# EAGLE design my board3 (EAGLE 6.2)
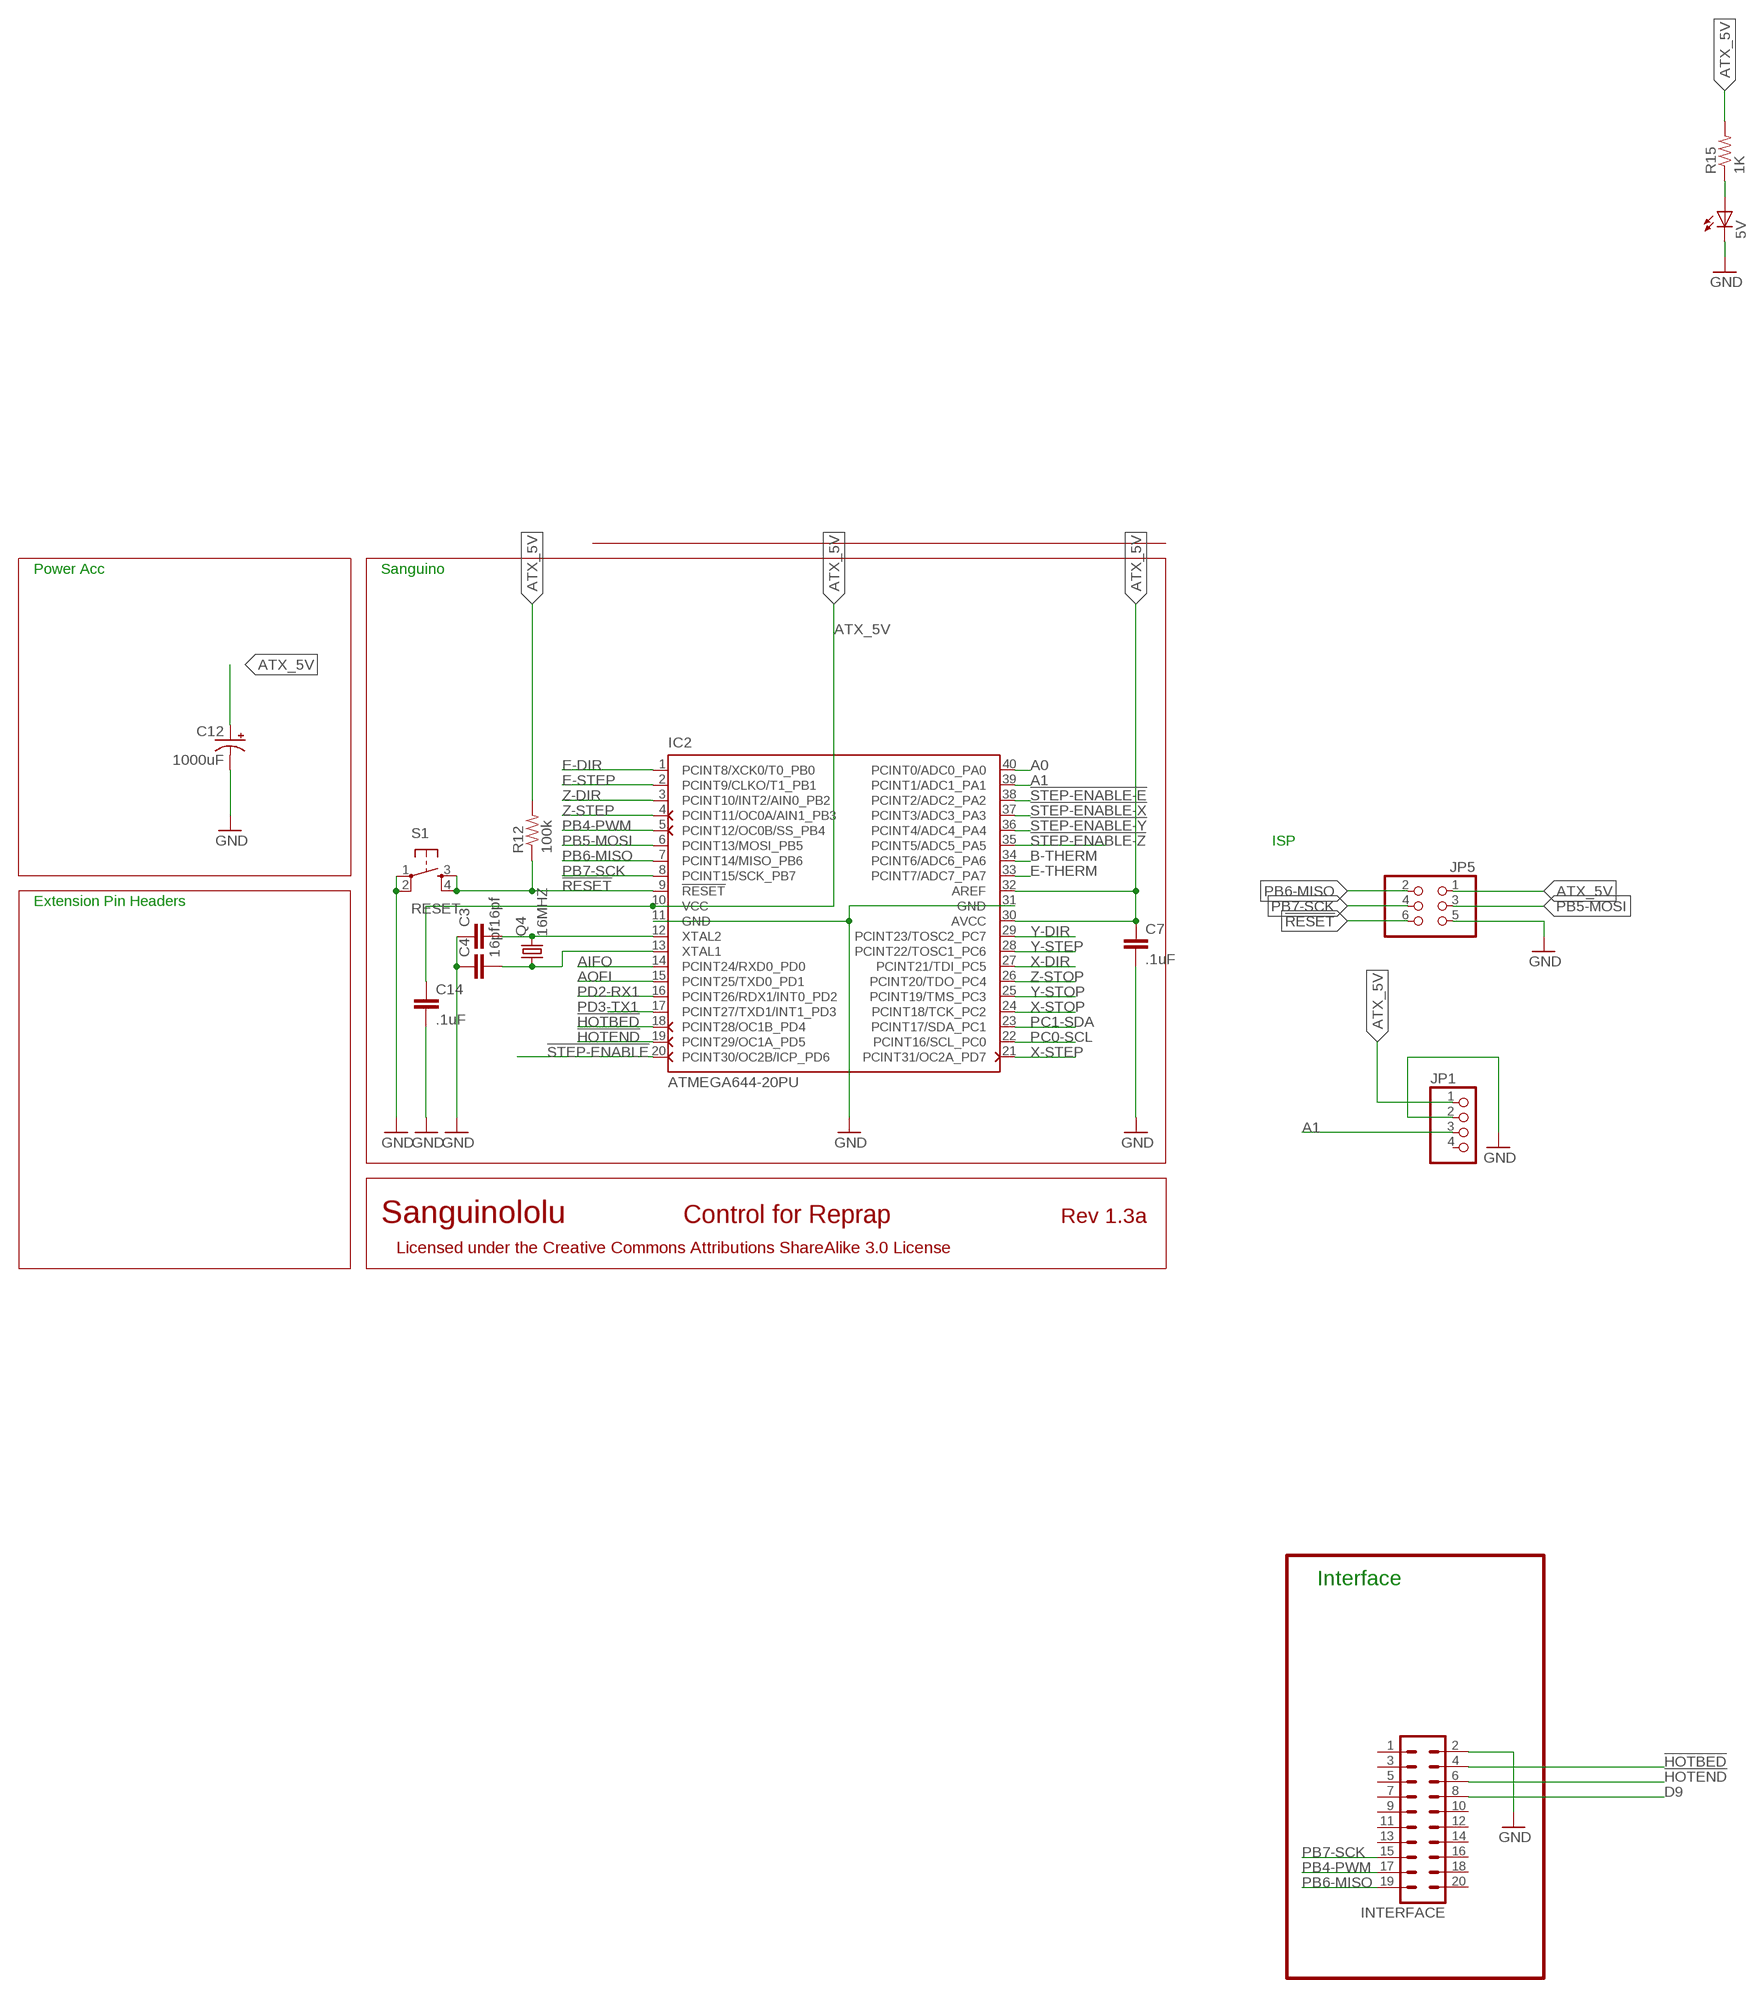
[diagram p0: schematic, sheet 1, part 1 of 2]
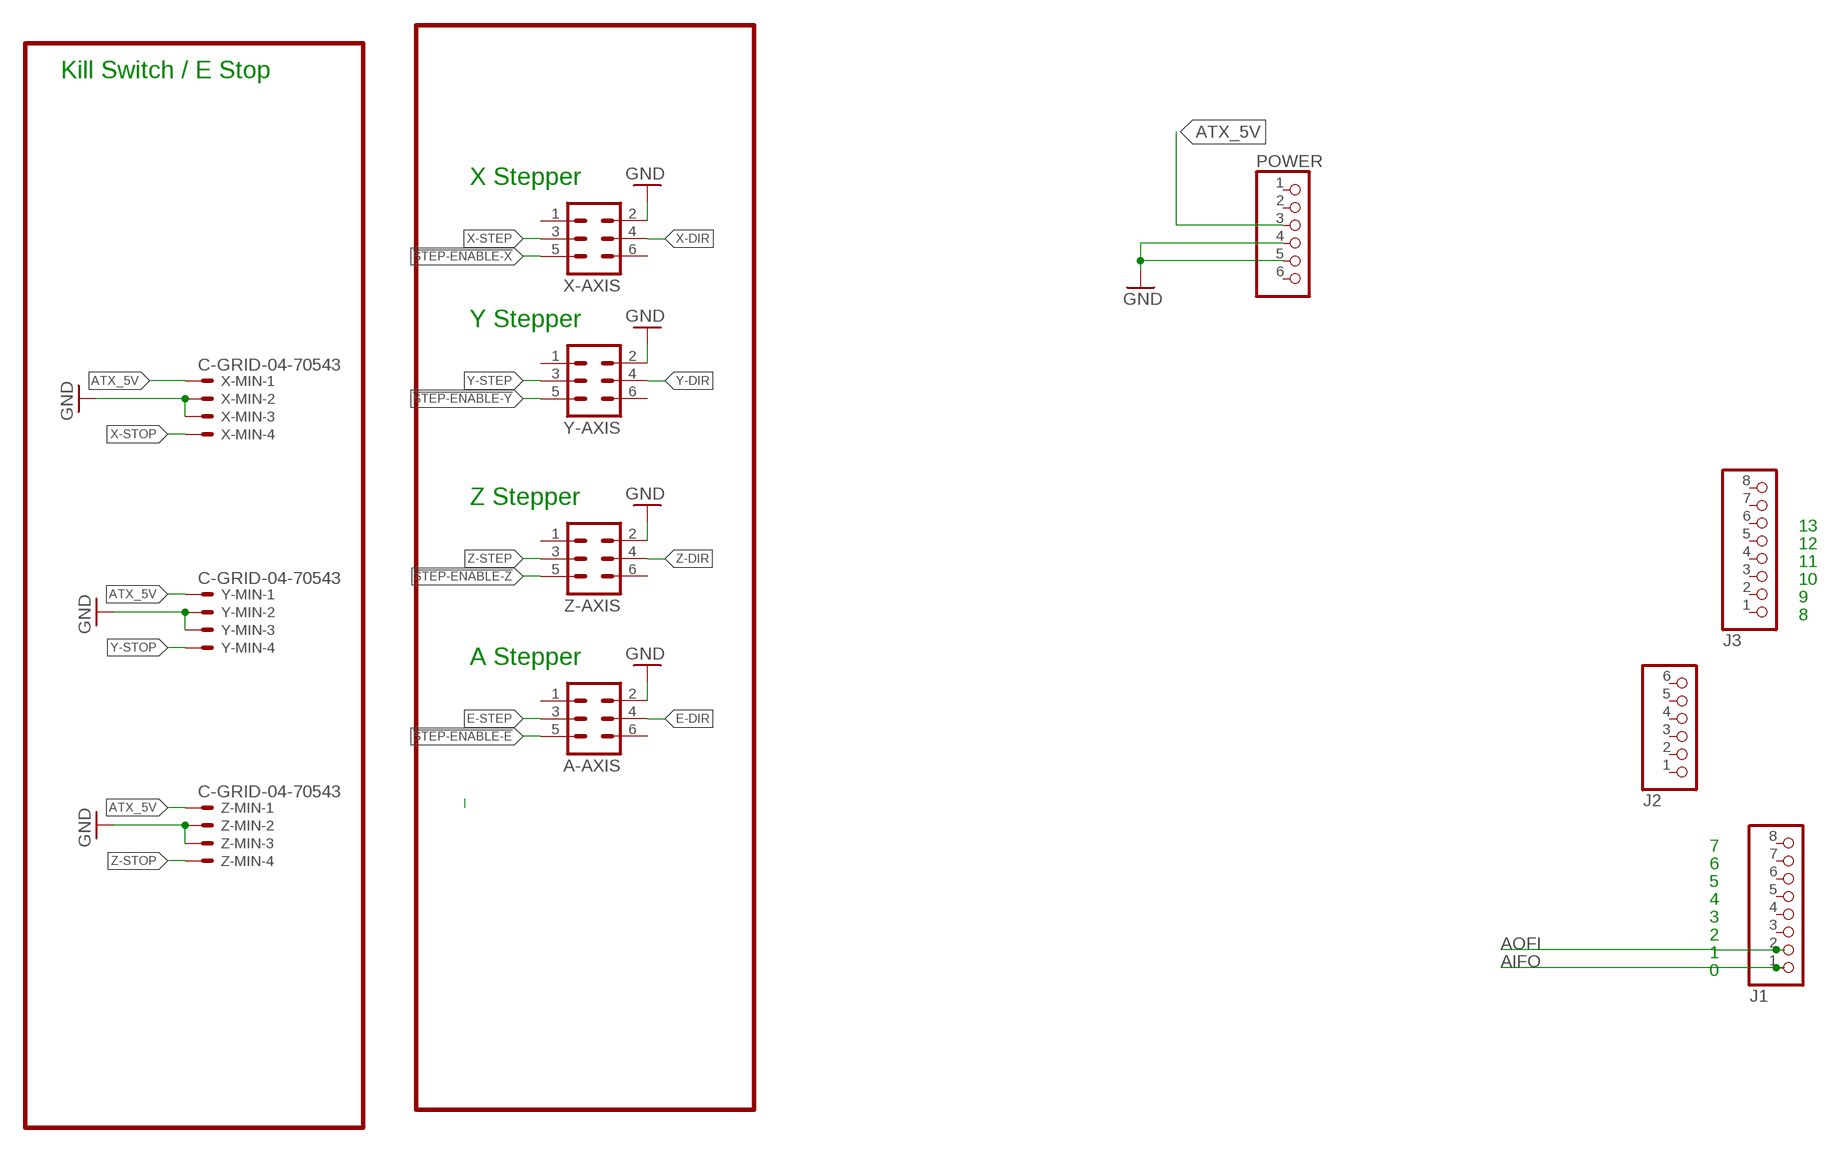
[diagram p1: schematic, sheet 1, part 2 of 2]

## Parts
5V  LED0805  [LED-0805]
A-AXIS  ML6  [ML6]
C3  16pf  CAP0805  [0805]
C4  16pf  CAP0805  [0805]
C7  .1uF  CAP0805  [0805]
C12  1000uF  CAP_POLPTH4  [CPOL-RADIAL-1000UF-25V]
C14  .1uF  CAP0805  [0805]
IC2  ATMEGA644-20PU  [DIL40]
INTERFACE  ML20  [ML20]
J1  PINHD-1X8  [1X08]
J2  PINHD-1X6  [1X06]
J3  PINHD-1X8  [1X08]
JP1  PINHD-1X4  [1X04]
JP5  PINHD-2X3  [2X03]
POWER  PINHD-1X6  [1X06]
Q4  16MHZ  CRYSTALHC49S  [HC49/S]
R12  100k  RESISTORPTH1  [AXIAL-0.3]
R15  1K  RESISTOR  [0805]
S1  RESET  TAC_SWITCHPTH  [TACTILE-PTH]
X-AXIS  ML6  [ML6]
X-MIN  C-GRID-04-70543  [70543-04]
Y-AXIS  ML6  [ML6]
Y-MIN  C-GRID-04-70543  [70543-04]
Z-AXIS  ML6  [ML6]
Z-MIN  C-GRID-04-70543  [70543-04]

## Nets
!HOTBED: IC2.18(PCINT28/OC1B_PD4) INTERFACE.4
!HOTEND: IC2.19(PCINT29/OC1A_PD5) INTERFACE.6
!RESET: IC2.9(!RESET) JP5.6 R12.P$1 S1.3 S1.4
!STEP-ENABLE: IC2.20(PCINT30/OC2B/ICP_PD6)
!STEP-ENABLE-E: A-AXIS.5 IC2.38(PCINT2/ADC2_PA2)
!STEP-ENABLE-X: IC2.37(PCINT3/ADC3_PA3) X-AXIS.5
!STEP-ENABLE-Y: IC2.36(PCINT4/ADC4_PA4) Y-AXIS.5
!STEP-ENABLE-Z: IC2.35(PCINT5/ADC5_PA5) Z-AXIS.5
A0: IC2.40(PCINT0/ADC0_PA0)
A1: IC2.39(PCINT1/ADC1_PA1) JP1.3
AIFO: IC2.14(PCINT24/RXD0_PD0) J1.1
AOFI: IC2.15(PCINT25/TXD0_PD1) J1.2
ATX_5V [usbvcc]: C7.1 C12.1(+) C14.1 IC2.10(VCC) IC2.30(AVCC) IC2.32(AREF) JP1.1 JP5.1 POWER.3 R12.P$2 R15.2 X-MIN.1 Y-MIN.1 Z-MIN.1
B-THERM: IC2.34(PCINT6/ADC6_PA6)
D9: INTERFACE.8
E-DIR: A-AXIS.4 IC2.1(PCINT8/XCK0/T0_PB0)
E-STEP: A-AXIS.3 IC2.2(PCINT9/CLKO/T1_PB1)
E-THERM: IC2.33(PCINT7/ADC7_PA7)
GND [gnd]: 5V.C A-AXIS.2 C3.1 C4.1 C7.2 C12.2(-) C14.2 IC2.11(GND) IC2.31(GND) INTERFACE.2 JP1.2 JP5.5 POWER.4 POWER.5 S1.1 S1.2 X-AXIS.2 X-MIN.2 X-MIN.3 Y-AXIS.2 Y-MIN.2 Y-MIN.3 Z-AXIS.2 Z-MIN.2 Z-MIN.3
N$25: 5V.A R15.1
N$31: C3.2 IC2.12(XTAL2) Q4.2
N$32: C4.2 IC2.13(XTAL1) Q4.1
PB4-PWM: IC2.5(PCINT12/OC0B/SS_PB4) INTERFACE.17
PB5-MOSI: IC2.6(PCINT13/MOSI_PB5) JP5.3
PB6-MISO: IC2.7(PCINT14/MISO_PB6) INTERFACE.19 JP5.2
PB7-SCK: IC2.8(PCINT15/SCK_PB7) INTERFACE.15 JP5.4
PC0-SCL: IC2.22(PCINT16/SCL_PC0)
PC1-SDA: IC2.23(PCINT17/SDA_PC1)
PD2-RX1: IC2.16(PCINT26/RDX1/INT0_PD2)
PD3-TX1: IC2.17(PCINT27/TXD1/INT1_PD3)
X-DIR: IC2.27(PCINT21/TDI_PC5) X-AXIS.4
X-STEP: IC2.21(PCINT31/OC2A_PD7) X-AXIS.3
X-STOP: IC2.24(PCINT18/TCK_PC2) X-MIN.4
Y-DIR: IC2.29(PCINT23/TOSC2_PC7) Y-AXIS.4
Y-STEP: IC2.28(PCINT22/TOSC1_PC6) Y-AXIS.3
Y-STOP: IC2.25(PCINT19/TMS_PC3) Y-MIN.4
Z-DIR: IC2.3(PCINT10/INT2/AIN0_PB2) Z-AXIS.4
Z-STEP: IC2.4(PCINT11/OC0A/AIN1_PB3) Z-AXIS.3
Z-STOP: IC2.26(PCINT20/TDO_PC4) Z-MIN.4
Unconnected: A-AXIS.1 A-AXIS.6 INTERFACE.1 INTERFACE.3 INTERFACE.5 INTERFACE.7 INTERFACE.9 INTERFACE.10 INTERFACE.11 INTERFACE.12 INTERFACE.13 INTERFACE.14 INTERFACE.16 INTERFACE.18 INTERFACE.20 J1.3 J1.4 J1.5 J1.6 J1.7 J1.8 J2.1 J2.2 J2.3 J2.4 J2.5 J2.6 J3.1 J3.2 J3.3 J3.4 J3.5 J3.6 J3.7 J3.8 JP1.4 POWER.1 POWER.2 POWER.6 X-AXIS.1 X-AXIS.6 Y-AXIS.1 Y-AXIS.6 Z-AXIS.1 Z-AXIS.6

## Notes on the sheet
- Power Acc | Sanguino
- Kill Switch / E Stop
- X Stepper
- ISP
- Extension Pin Headers
- Y Stepper
- Z Stepper
- 13
- 12
- 11
- 10
- 9
- 8
- Sanguinololu | Control for Reprap | Rev 1.3a
- A Stepper
- Licensed under the Creative Commons Attributions ShareAlike 3.0 License
- 7
- 6
- 5
- 4
- 3
- 2
- 1
- 0
- Interface

## Library data of the parts
5V = SparkFun:LED: LEDs Standard schematic elements and footprints for 5mm, 3mm, 1206, and 0603 sized LEDs. 5mm - Spark Fun Electronics SKU : COM-00529 (and others)
A-AXIS X-AXIS Y-AXIS Z-AXIS = con-ml:ML6: HARTING
C3 C4 C7 C14 = SparkFun:CAP: Capacitor Standard 0603 ceramic capacitor, and 0.1" leaded capacitor.
C12 = SparkFun:CAP_POL: Capacitor Polarized These are standard SMD and PTH capacitors. Normally 10uF, 47uF, and 100uF in electrolytic and tantalum varieties. Always verify the external diameter of the through hole cap, it varies with capacity, voltage, and manufacturer. The EIA devices should be standard.
IC2 = atmel:ATMEGA644-*PU: 8-bit Microcontroller with 64K Bytes In-System Programmable Flash Auto generated by make-symbol-device-package-bsdl.ulp Rev. 34 Source: http://www.atmel.com/dyn/resources/prod_documents/doc2593.pdf; MPN: ATMEGA644-20PU; OC_FARNELL: 1288340; OC_NEWARK: 23M5060
INTERFACE = con-harting-ml:ML20: HARTING
J1 J3 = pinhead:PINHD-1X8: PIN HEADER
J2 POWER = pinhead:PINHD-1X6: PIN HEADER
JP1 = pinhead:PINHD-1X4: PIN HEADER
JP5 = pinhead:PINHD-2X3: PIN HEADER
Q4 = crystal:CRYSTAL: CRYSTAL
R12 R15 = SparkFun:RESISTOR: Resistor Basic schematic elements and footprints for 0603, 1206, and PTH 1/10th watt (small) resistors.
S1 = SparkFun:TAC_SWITCH: Momentary Switch Button commonly used for reset or general input. Spark Fun Electronics SKU : COM-00097
X-MIN Y-MIN Z-MIN = con-molex:C-GRID-04: CONNECTOR wire to board 2.54 mm (0.100") pitch header

## Net classes
0 default: width 0.203 mm
1 power: width 0.254 mm
2 gnd: width 0.305 mm, drill 0.711 mm, clearance 0.203 mm
3 usbvcc: width 0.508 mm, drill 0.711 mm, clearance 0.203 mm
4 aref: width 0.406 mm

## Board
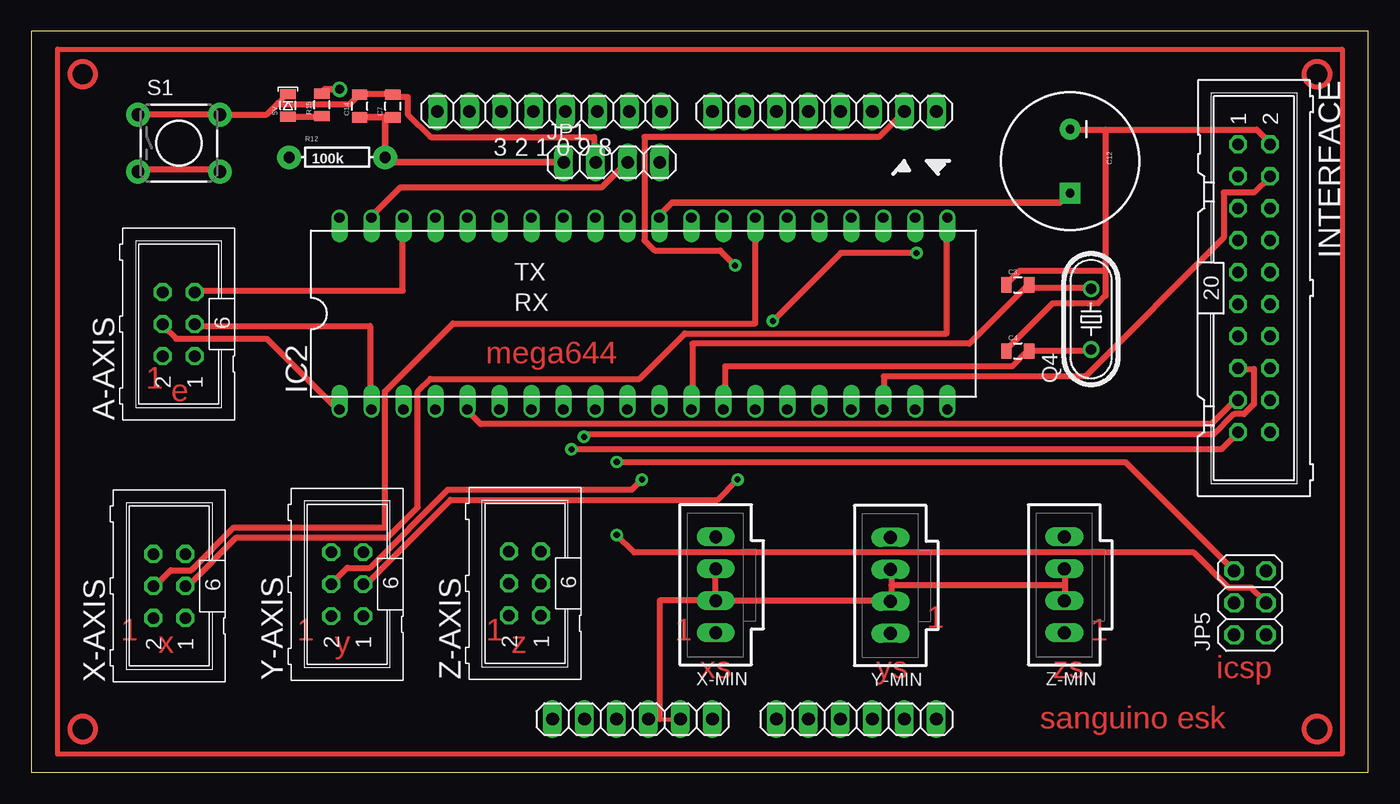
[diagram p2: board, top side]
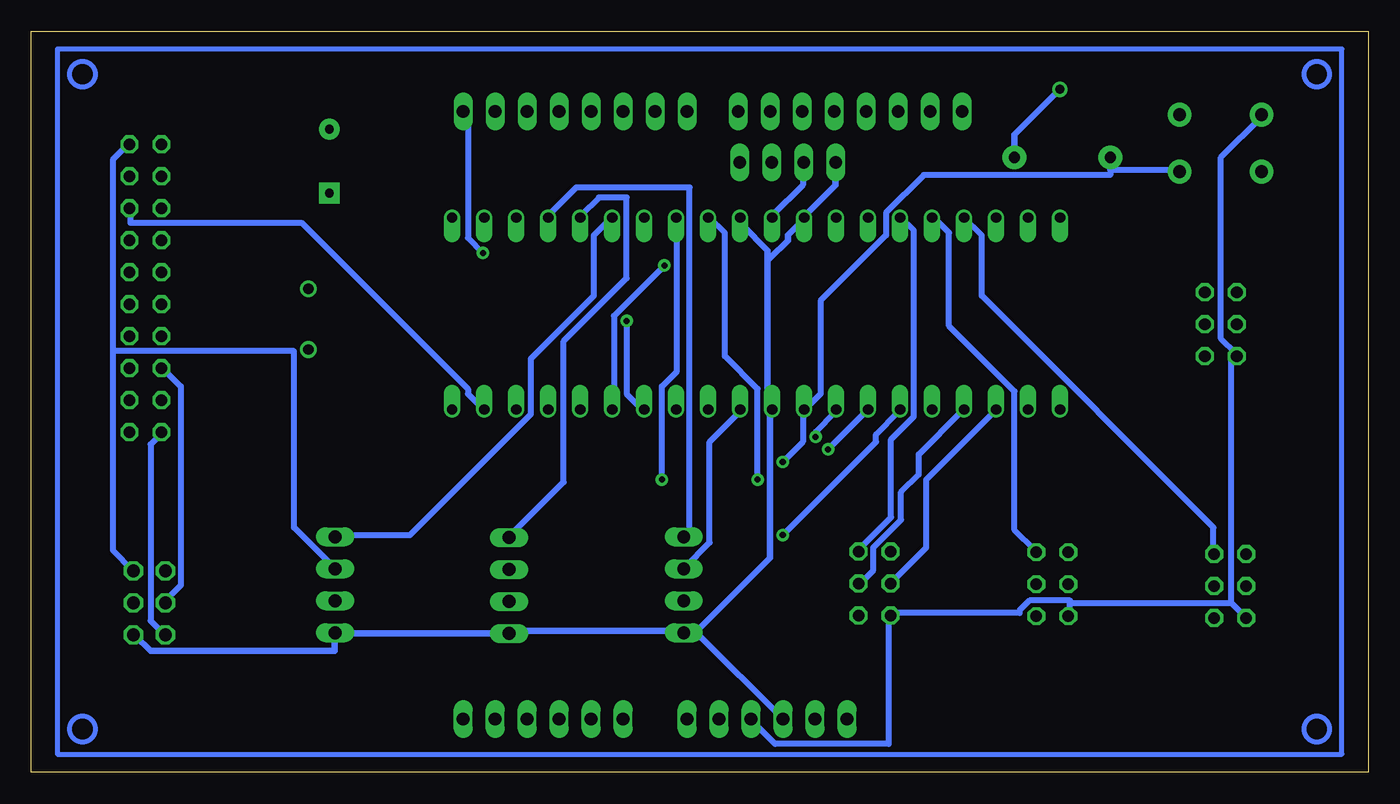
[diagram p3: board, bottom side, seen from below]

Size 106.12 x 58.84 mm. Coordinates in mm from the lower left corner, seen from the top.
Outline: 0,0 106.12,0 106.12,58.84 0,58.84 0,0
Copper layers (1*16): Top 0.035mm / dielectric 1.5mm / Bottom 0.035mm
Design rules: minimum track width 19mil, minimum drill 19mil, track to track 6mil, track to pad 6mil, pad to pad 6mil, via to via 6mil, smd to smd 6mil, copper to edge 30mil, drill to drill 6mil, minimum pad ring 10mil, minimum via ring 10mil, stop-mask expansion 4mil, vias tented up to drill 0mil, thermal gap 10mil

### Footprints (pad centres in the part's own frame; a part is rotated, then mirrored left to right if it is on the bottom)
LED-0805 = smd 1.2 x 0.8: A 0,-0.9; C 0,0.9
ML6 = drill 0.914 octagon: 1 -2.54,-1.27; 2 -2.54,1.27; 3 0,-1.27; 4 0,1.27; 5 2.54,-1.27; 6 2.54,1.27
0805 = smd 0.8 x 1.2: 1 -0.9,0; 2 0.9,0
CPOL-RADIAL-1000UF-25V = drill 0.7 pad 1.651 square: 1 2.54,0 | drill 0.7 pad 1.651: 2 -2.54,0
DIL40 = drill 0.813 offset: 1 -24.13,-7.62; 2 -21.59,-7.62; 3 -19.05,-7.62; 4 -16.51,-7.62; 5 -13.97,-7.62; 6 -11.43,-7.62; 7 -8.89,-7.62; 8 -6.35,-7.62; 9 -3.81,-7.62; 10 -1.27,-7.62; 11 1.27,-7.62; 12 3.81,-7.62; 13 6.35,-7.62; 14 8.89,-7.62; 15 11.43,-7.62; 16 13.97,-7.62; 17 16.51,-7.62; 18 19.05,-7.62; 19 21.59,-7.62; 20 24.13,-7.62; 21 24.13,7.62; 22 21.59,7.62; 23 19.05,7.62; 24 16.51,7.62; 25 13.97,7.62; 26 11.43,7.62; 27 8.89,7.62; 28 6.35,7.62; 29 3.81,7.62; 30 1.27,7.62; 31 -1.27,7.62; 32 -3.81,7.62; 33 -6.35,7.62; 34 -8.89,7.62; 35 -11.43,7.62; 36 -13.97,7.62; 37 -16.51,7.62; 38 -19.05,7.62; 39 -21.59,7.62; 40 -24.13,7.62
ML20 = drill 0.914 octagon: 1 -11.43,-1.27; 2 -11.43,1.27; 3 -8.89,-1.27; 4 -8.89,1.27; 5 -6.35,-1.27; 6 -6.35,1.27; 7 -3.81,-1.27; 8 -3.81,1.27; 9 -1.27,-1.27; 10 -1.27,1.27; 11 1.27,-1.27; 12 1.27,1.27; 13 3.81,-1.27; 14 3.81,1.27; 15 6.35,-1.27; 16 6.35,1.27; 17 8.89,-1.27; 18 8.89,1.27; 19 11.43,-1.27; 20 11.43,1.27
1X08 = drill 1.016 long: 1 -8.89,0; 2 -6.35,0; 3 -3.81,0; 4 -1.27,0; 5 1.27,0; 6 3.81,0; 7 6.35,0; 8 8.89,0
1X06 = drill 1.016 long: 1 -6.35,0; 2 -3.81,0; 3 -1.27,0; 4 1.27,0; 5 3.81,0; 6 6.35,0
1X04 = drill 1.016 long: 1 -3.81,0; 2 -1.27,0; 3 1.27,0; 4 3.81,0
2X03 = drill 1.016 octagon: 1 -2.54,-1.27; 2 -2.54,1.27; 3 0,-1.27; 4 0,1.27; 5 2.54,-1.27; 6 2.54,1.27
HC49/S = drill 0.813: 1 -2.413,0; 2 2.413,0
AXIAL-0.3 = drill 0.9 pad 1.88: P$1 -3.81,0; P$2 3.81,0
TACTILE-PTH = drill 1.016 pad 1.88: 1 -3.251,2.261; 2 3.251,2.261; 3 -3.251,-2.261; 4 3.251,-2.261
70543-04 = drill 1.016 long: 1 -3.81,0; 2 -1.27,0; 3 1.27,0; 4 3.81,0

### Placement (x,y rotation side)
5V  20.36,52.96 0 top
A-AXIS  11.69,35.59 90 top
C3  78.32,38.72 0 top
C4  78.32,33.48 0 top
C7  28.69,52.91 90 top
C12  82.47,48.54 270 top
C14  26.05,52.91 90 top
IC2  48.58,36.44 0 top
INTERFACE  97.07,38.45 270 top
J1  62.96,52.49 180 top
J2  65.5,4.23 0 top
J3  41.12,52.49 180 top
JP1  46.07,48.45 0 top
JP5  96.76,13.46 90 top
POWER  47.72,4.23 0 top
Q4  84.13,35.99 90 top
R12  24.27,48.85 0 top
R15  23.05,53.01 90 top
S1  11.71,49.97 0 top
X-AXIS  10.94,14.79 90 top
X-MIN  54.32,14.9 90 top
Y-AXIS  25.06,14.95 90 top
Y-MIN  68.19,14.85 90 top
Z-AXIS  39.19,15 90 top
Z-MIN  82.01,14.9 90 top

### Tracks (layer width: path | path; a pad name or v marks a point on that pad's centre or on a via)
!HOTBED
  Top 0.483: IC2.18 67.67,28.85 67.67,31.45 83.67,31.45 94.67,42.45 94.67,46.05 97.07,46.05 98.27,47.25 INTERFACE.4
!HOTEND
  Bottom 0.483: IC2.19 70.27,28.85 71.47,30.05 71.47,30.45 84.67,43.65 98.27,43.65 98.27,44.65 INTERFACE.6
!RESET  (via drill 0.48)
  Top 0.483: 8.47,47.85 S1.3 8.67,47.85 14.67,47.85 S1.4 14.87,47.85 | v46.47,24.65 86.87,24.65 95.47,16.05 JP5.6
  Bottom 0.483: 20.47,47.85 20.47,48.65 R12.P$1 | 20.47,47.85 20.47,47.45 35.27,47.45 38.27,44.45 38.27,42.65 43.47,37.45 43.47,30.05 44.67,28.85 IC2.9 44.87,28.65 44.87,26.25 v46.47,24.65 | 20.47,47.85 15.07,47.85 S1.4
!STEP-ENABLE-E
  Top 0.483: IC2.38 29.47,44.05 29.47,38.25 13.07,38.25 A-AXIS.5
!STEP-ENABLE-X
  Bottom 0.483: IC2.37 30.67,42.65 30.67,37.85 12.27,19.45 12.27,17.45 X-AXIS.5
!STEP-ENABLE-Y
  Bottom 0.483: IC2.36 34.47,44.05 33.27,42.85 33.27,35.45 28.07,30.25 28.07,19.25 26.47,17.65 Y-AXIS.5
!STEP-ENABLE-Z
  Bottom 0.483: IC2.35 37.07,44.05 36.07,43.05 36.07,28.25 37.87,26.45 37.87,20.25 40.27,17.85 40.27,17.65 Z-AXIS.5
A1
  Top 0.483: IC2.39 27.07,44.25 29.27,46.45 45.27,46.45 47.27,48.45 JP1.3
AIFO  (via drill 0.48)
  Top 0.483: v58.87,35.85 64.27,41.25 v70.27,41.25
  Bottom 0.483: v58.87,35.85 58.87,30.05 57.67,28.85 IC2.14 | v70.27,41.25 71.47,42.45 71.47,52.25 71.67,52.45 J1.1
AOFI  (via drill 0.48)
  Top 0.483: v55.87,40.25 54.67,41.45 49.47,41.45 48.67,42.25 48.67,50.45 67.27,50.45 69.27,52.45 J1.2
  Bottom 0.483: v55.87,40.25 59.87,36.25 59.87,28.85 IC2.15
ATX_5V  (via drill 0.71)
  Top 0.508: 28.07,52.05 28.67,52.05 C7.1 | 28.07,52.05 26.07,52.05 C14.1 | v24.47,54.25 23.27,54.25 23.07,54.05 R15.2 | 28.07,52.05 R12.P$2 28.27,48.65 28.47,48.45 JP1.1 | C12.1 82.27,45.85 81.67,45.25 50.87,45.25 49.87,44.25 IC2.30
  Bottom 0.508: POWER.3 46.47,4.25 53.27,11.05 54.27,11.05 X-MIN.1 | JP5.1 97.87,10.85 96.67,9.65 82.07,9.65 82.07,10.85 Z-MIN.1 81.87,11.05 68.27,11.05 Y-MIN.1 68.07,11.25 54.47,11.25 X-MIN.1 | v24.47,54.25 28.07,50.65 R12.P$2 | JP1.1 42.27,46.65 44.67,44.25 IC2.32 44.87,43.85 46.07,42.65 46.07,42.25 47.47,40.85 47.67,40.85 | 47.67,40.85 47.67,41.45 49.67,43.45 49.67,44.05 IC2.30 | 47.67,40.85 47.67,29.05 47.47,28.85 IC2.10 47.47,28.65 47.47,17.05 53.27,11.25 X-MIN.1
E-DIR
  Top 0.483: IC2.1 24.27,28.85 18.67,34.45 11.47,34.45 10.47,35.45 A-AXIS.4
E-STEP
  Top 0.483: IC2.2 26.87,28.85 26.87,35.45 13.07,35.45 A-AXIS.3
GND
  Top 0.305: POWER.4 49.87,4.23 POWER.5
  Top 0.483: 47.27,44.05 IC2.31 | 49.87,28.85 IC2.11 | X-MIN.2 54.27,13.65 54.27,16.05 X-MIN.3 | 85.27,39.85 85.27,37.85 84.67,37.25 81.07,37.25 77.47,33.65 C4.1 | 85.27,39.85 78.47,39.85 77.47,38.85 C3.1 | 85.27,51.05 82.47,51.05 C12.2 | 85.27,51.05 97.27,51.05 98.27,50.05 INTERFACE.2 | 85.27,51.05 85.27,39.85 | 68.27,14.85 68.27,16.05 Y-MIN.3 | 68.27,14.85 68.27,13.65 Y-MIN.2 68.07,13.65 54.47,13.65 X-MIN.2 | 82.07,14.85 82.07,16.05 Z-MIN.3 | 82.07,14.85 82.07,13.65 Z-MIN.2 | 82.07,14.85 68.27,14.85 | 49.87,4.23 49.87,13.65 54.07,13.65 X-MIN.2 | 19.57,53.15 18.67,52.25 15.07,52.25 S1.2 14.87,52.25 8.47,52.25 S1.1 | 19.57,53.15 20.27,53.85 5V.C | 19.57,53.15 19.67,53.05 25.27,53.05 25.87,53.65 C14.2 26.07,53.85 28.67,53.85 C7.2 28.87,53.65 29.87,53.65 29.87,52.25 31.67,50.45 44.67,50.45 44.67,48.45 JP1.2
  Bottom 0.483: 99.67,33.45 99.67,48.65 98.47,49.85 INTERFACE.2 | 99.67,33.45 99.67,17.65 98.07,16.05 JP5.5 | IC2.11 49.87,28.65 52.27,26.25 52.27,18.25 54.27,16.25 X-MIN.3 | IC2.31 47.27,44.25 44.87,46.65 44.87,48.45 JP1.2 | 10.87,13.45 9.87,12.45 X-AXIS.2 | 23.67,13.45 10.87,13.45 | 23.67,13.45 23.67,12.45 Y-AXIS.2 | 23.67,13.45 23.67,13.65 26.87,13.65 27.67,12.85 27.67,12.65 37.87,12.65 Z-AXIS.2 38.07,12.25 38.07,2.25 47.07,2.25 48.87,4.05 POWER.4 | 10.87,13.45 10.87,32.65 10.47,33.05 A-AXIS.2 10.47,33.25 11.67,34.45 11.67,48.85 8.47,52.05 S1.1 | 99.67,33.45 85.27,33.45 85.27,19.45 82.07,16.25 Z-MIN.3
N$1
  Top 0.406: 2.07,57.45 104.07,57.45 104.07,1.45 2.07,1.45 2.07,57.45
N$2
  Bottom 0.406: 2.07,57.45 104.07,57.45 104.07,1.45 2.07,1.45 2.07,57.45
N$25
  Top 0.483: 5V.A 20.47,52.05 22.87,52.05 R15.1
N$31
  Top 0.483: Q4.2 84.07,38.45 79.47,38.45 79.27,38.65 C3.2 79.07,38.65 74.47,34.05 52.47,34.05 52.47,28.85 IC2.12
N$32
  Top 0.483: Q4.1 84.07,33.45 79.27,33.45 C4.2 79.07,33.45 77.87,32.25 55.07,32.25 55.07,28.85 IC2.13
PB4-PWM
  Top 0.483: IC2.5 34.67,28.65 35.67,27.65 93.67,27.65 95.47,29.45 95.67,29.45 INTERFACE.17
PB5-MOSI  (via drill 0.48)
  Top 0.483: v46.47,18.85 47.87,17.45 92.27,17.45 95.07,14.65 96.87,14.65 97.87,13.65 JP5.3
  Bottom 0.483: v46.47,18.85 39.07,26.25 39.07,26.85 37.27,28.65 IC2.6
PB6-MISO  (via drill 0.48)
  Top 0.483: v42.87,25.65 94.47,25.65 95.67,26.85 INTERFACE.19
  Bottom 0.483: v42.87,25.65 39.87,28.65 IC2.7 | JP5.2 95.67,11.05 96.67,12.05 96.67,26.05 95.87,26.85 INTERFACE.19
PB7-SCK  (via drill 0.48)
  Top 0.483: v43.87,26.65 44.07,26.85 93.87,26.85 95.47,28.45 96.27,28.45 97.07,29.25 97.07,32.05 95.87,32.05 INTERFACE.15
  Bottom 0.483: v43.87,26.65 43.87,27.05 42.27,28.65 IC2.8 | JP5.4 95.47,13.65 94.27,14.85 94.27,30.65 95.67,32.05 INTERFACE.15
X-DIR
  Top 0.483: IC2.27 57.47,35.65 33.47,35.65 28.07,30.25 28.07,19.45 16.07,19.45 12.67,16.05 11.07,16.05 9.87,14.85 X-AXIS.4
X-STEP
  Top 0.483: IC2.21 72.67,44.05 72.67,34.85 51.87,34.85 48.27,31.25 31.67,31.25 30.67,30.25 30.67,21.05 28.27,18.65 16.27,18.65 12.47,14.85 12.27,14.85 X-AXIS.3
X-STOP
  Bottom 0.483: IC2.24 65.07,44.25 62.87,46.45 53.87,46.45 53.87,19.25 54.27,18.85 X-MIN.4
Y-DIR  (via drill 0.48)
  Top 0.483: v48.47,23.25 47.67,22.45 33.07,22.45 26.87,16.25 25.07,16.25 23.87,15.05 Y-AXIS.4
  Bottom 0.483: v48.47,23.25 48.47,30.45 51.07,33.05 51.07,42.85 52.27,44.05 IC2.29
Y-STEP  (via drill 0.48)
  Top 0.483: v56.07,23.25 54.47,21.65 33.27,21.65 26.67,15.05 26.47,15.05 Y-AXIS.3
  Bottom 0.483: v56.07,23.25 56.07,30.65 54.87,31.85 54.87,44.05 IC2.28
Y-STOP
  Bottom 0.483: IC2.25 62.47,44.25 61.07,45.65 58.87,45.65 58.87,39.25 63.87,34.25 63.87,23.05 68.07,18.85 Y-MIN.4
Z-DIR
  Bottom 0.483: IC2.3 29.67,28.65 35.07,23.25 35.07,17.85 37.87,15.05 Z-AXIS.4
Z-STEP
  Bottom 0.483: IC2.4 32.27,28.65 35.67,25.25 35.67,23.65 37.07,22.25 37.07,20.05 39.27,17.85 39.27,16.05 40.27,15.05 Z-AXIS.3
Z-STOP
  Bottom 0.483: IC2.26 60.07,44.05 61.47,42.65 61.47,37.85 66.47,32.85 66.47,28.45 76.07,18.85 81.87,18.85 Z-MIN.4
(copper drawn outside any net)
  shapes: Bottom circle x4, Top circle x4

### Text on the board
Top: mega644 | 1 | e | 1 | 1 | 1 | 1 | 1 | 1 | x | y | z | xs | ys | zs | icsp | sanguino esk
tNames: 3 2 1 0 9 8 | TX | RX